# EAGLE schematic 4xy-81950-00-00_hazard-relay (EAGLE 6.4)
Yamaha XVZ1300TF Hazard Warning Relay (4XY-81950-00) This details the connections and inner workings of the hazard warning relay on the Yamaha Royal Star Venture, US model
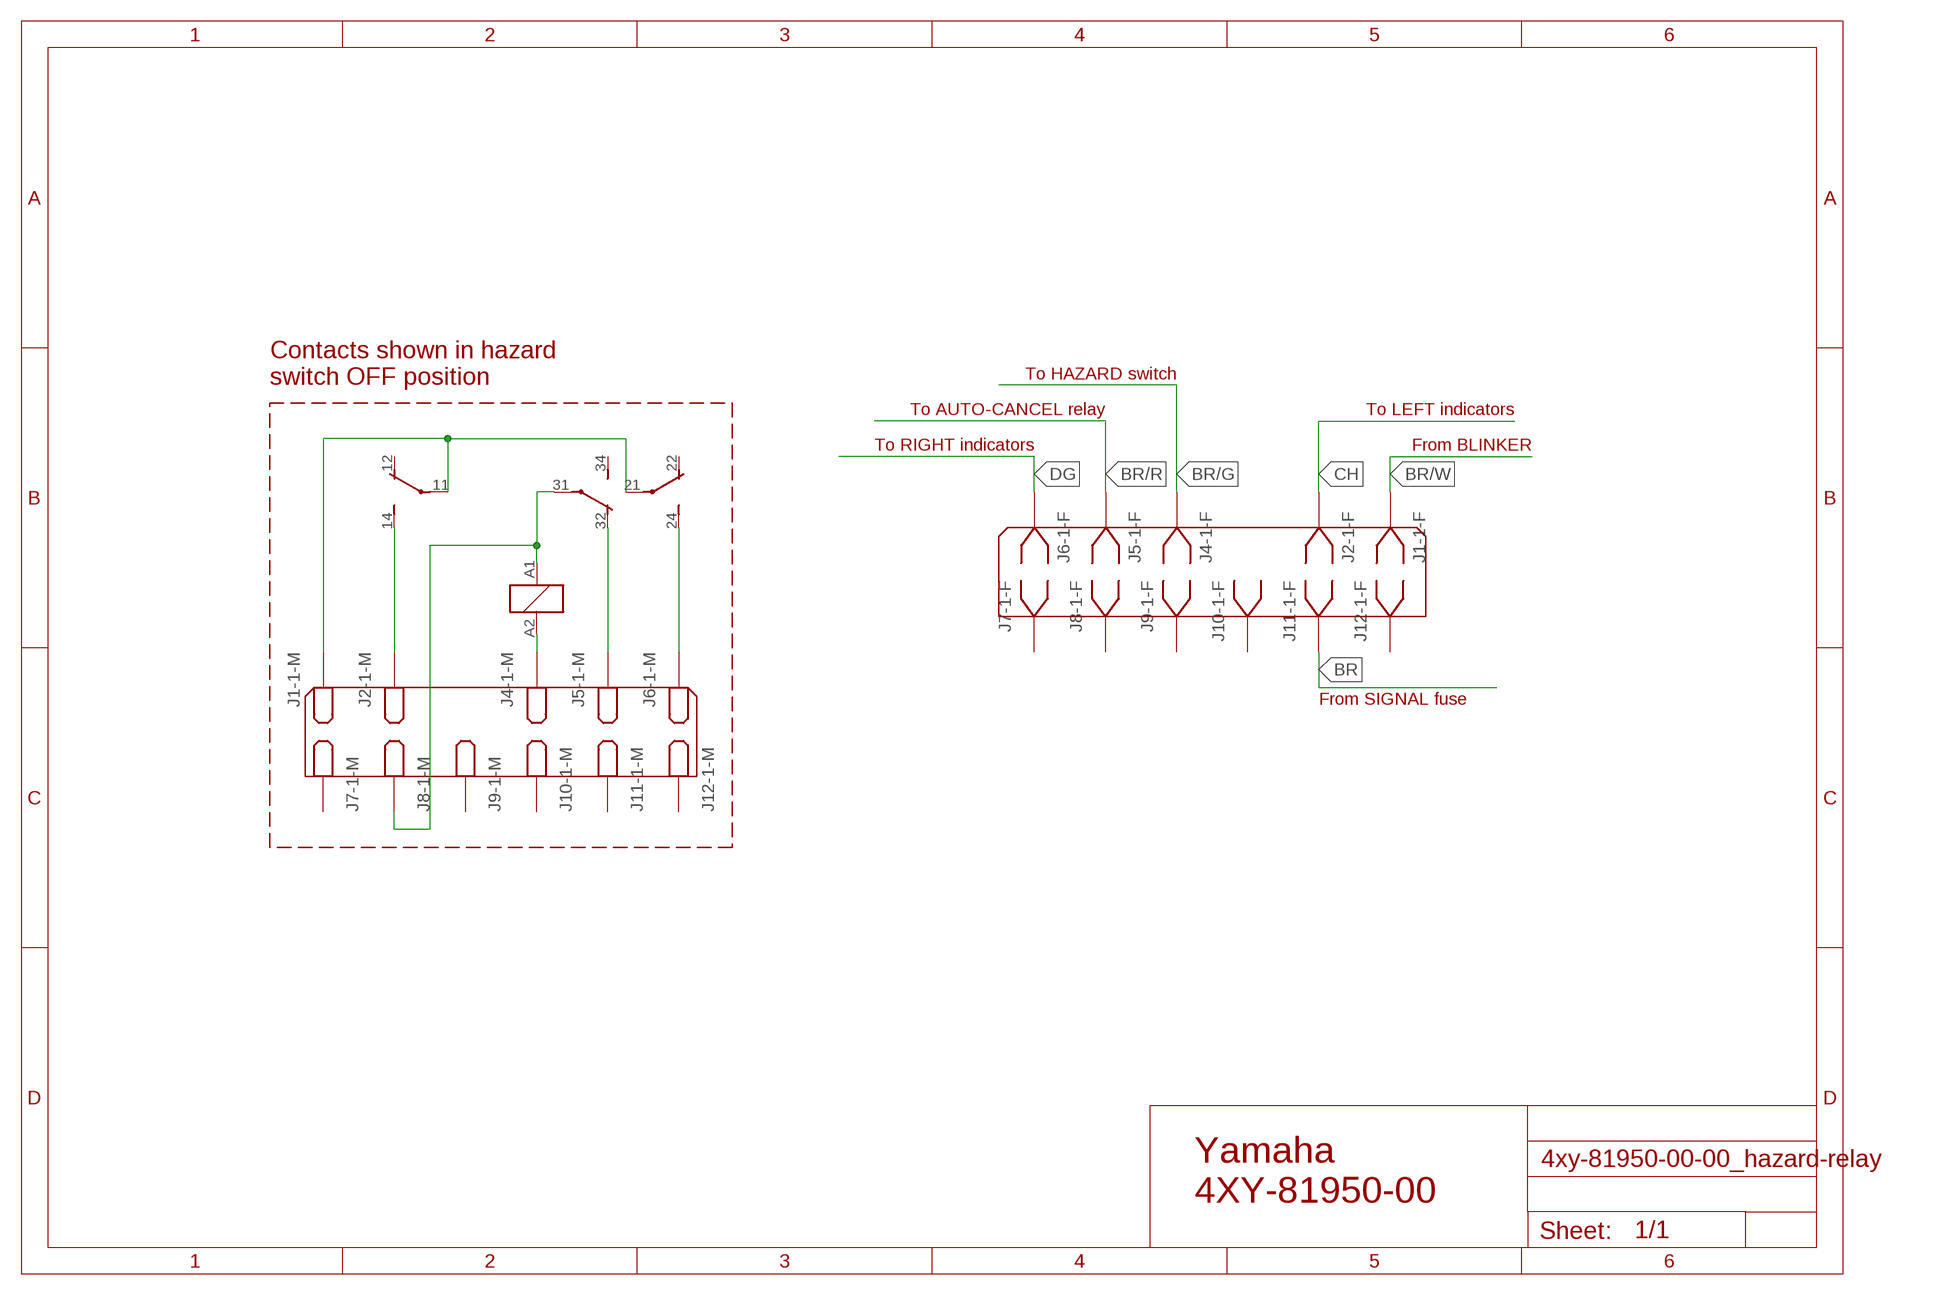
[diagram p0: schematic, sheet 1]

## Parts
K1  PT381730  [PT-3]

## Nets
P$1: K1.11(2:P) K1.14(2:S) K1.21(3:P) K1.24(3:S) K1.31(4:P) K1.32(4:O) K1.A1 K1.A2 ; supply symbol labelled SPADE_1WAY
Unconnected: K1.12(2:O) K1.22(3:O) K1.34(4:S)

## Notes on the sheet
- To HAZARD switch
- Contacts shown in hazard
  switch OFF position
- To AUTO-CANCEL relay | To LEFT indicators
- To RIGHT indicators | From BLINKER
- From SIGNAL fuse
- Yamaha
  4XY-81950-00

## Library data of the parts
K1 = relay:PT3*: Miniature Relay SCHRACK 3 pole 10 A DC- or AC-coil Source: http://www.schrack.com/.. 5823.pdf Socked 78603 Source: http://www.schrack.com/.. 5836.pdf; OC_FARNELL: unknown; OC_NEWARK: unknown